# Altium schematic sheet S3C.SchDoc
size A4; Organization: UltraZohm; SheetNumber: 8
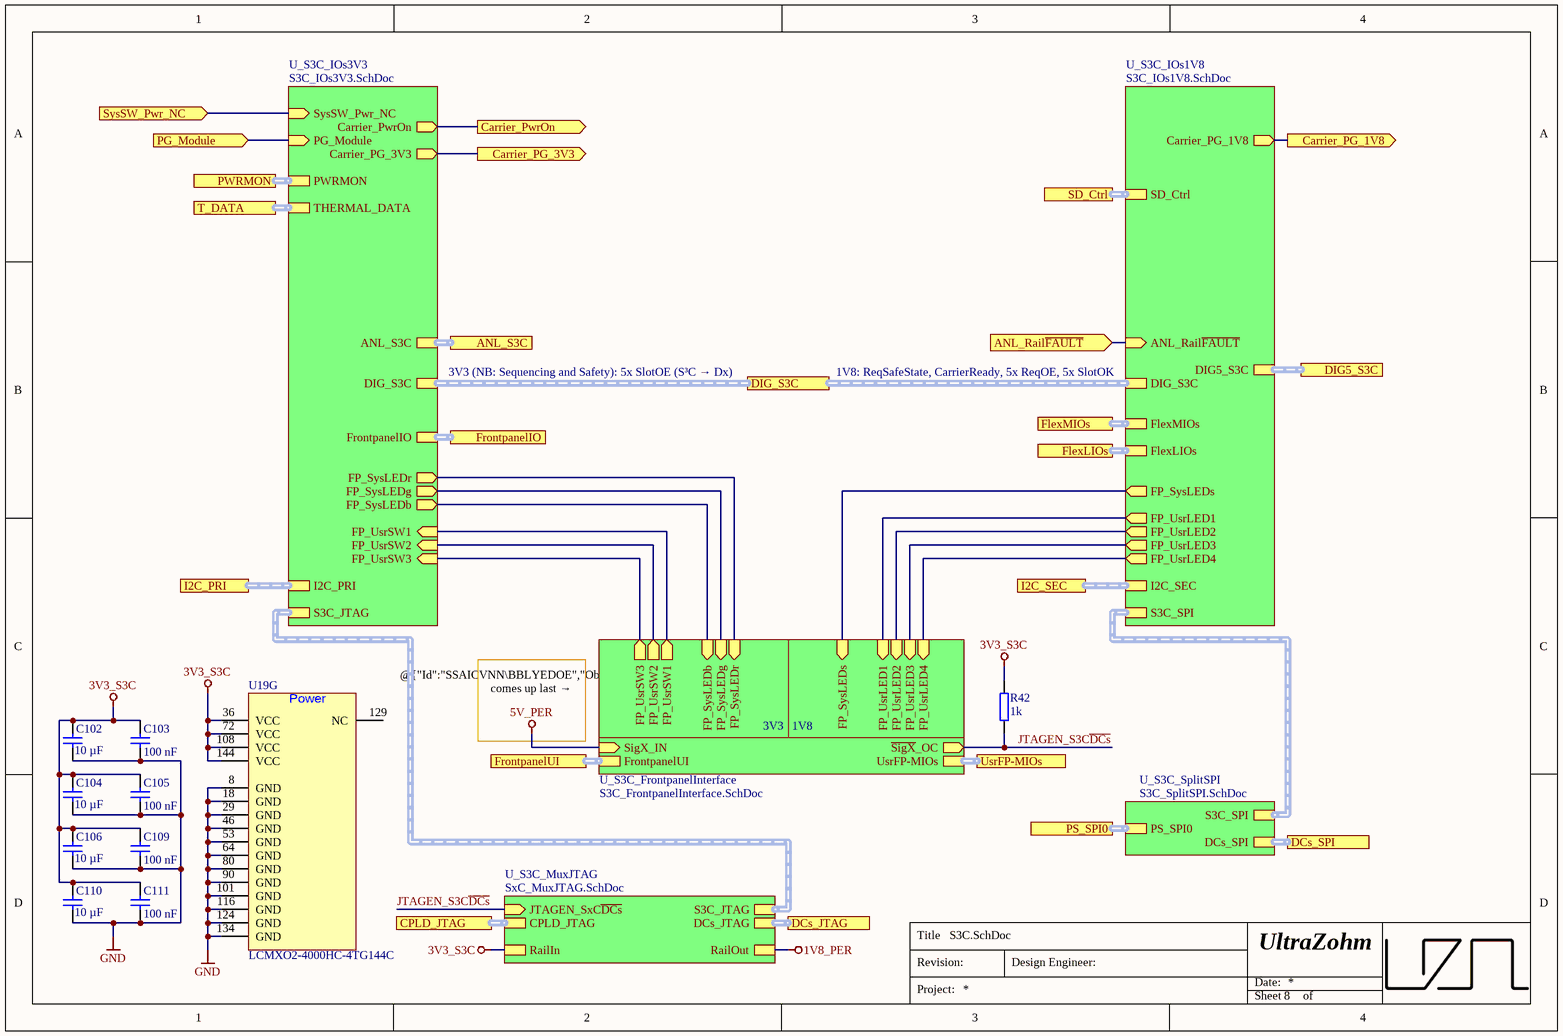
[diagram p0: S3C.SchDoc]

## Parts
C102  10 µF  [C_0603_TE]
C103  100 nF  [C_0603_TE]
C104  10 µF  [C_0603_TE]
C105  100 nF  [C_0603_TE]
C106  10 µF  [C_0603_TE]
C109  100 nF  [C_0603_TE]
C110  10 µF  [C_0603_TE]
C111  100 nF  [C_0603_TE]
R42  1k  [R_0603_TE]
U19  LCMXO2-4000HC-4TG144C  [QFP50P2200X2200X160-144N]  (part G of 7)

## Sub-sheets
U_S3C_FrontpanelInterface = S3C_FrontpanelInterface.SchDoc: SigX_IN (in), ~{SigX}_OC (out), FP_UsrLED1 (in), FP_UsrLED2 (in), FP_UsrLED3 (in), FP_UsrLED4 (in), FP_UsrSW1 (out), FP_UsrSW2 (out), FP_UsrSW3 (out), FP_SysLEDb (in), FP_SysLEDr (in), FP_SysLEDg (in), FP_SysLEDs (in), FrontpanelUI (harness FrontpanelUI), UsrFP-MIOs (harness UsrFP-MIOs)
U_S3C_IOs1V8 = S3C_IOs1V8.SchDoc: S3C_SPI (harness SPI_S3C), FlexMIOs (harness FlexMIOs), DIG5_S3C (harness DIG5_S3C), SD_Ctrl (harness SD_Ctrl), I2C_SEC (harness I2C), FP_UsrLED1 (out), FP_UsrLED2 (out), FP_UsrLED3 (out), FP_UsrLED4 (out), FP_SysLEDs (out), Carrier_PG_1V8 (out), DIG_S3C (harness DIG_S3C), FlexLIOs (harness FlexLIOs), ANL_Rail~{FAULT} (in)
U_S3C_IOs3V3 = S3C_IOs3V3.SchDoc: S3C_JTAG (harness JTAG_S3C), I2C_PRI (harness I2C), SysSW_Pwr_NC (in), THERMAL_DATA (harness T_DATA), FrontpanelIO (harness FrontpanelIO), PWRMON (harness S3C_PWRMON), ANL_S3C (harness ANL_S3C), Carrier_PwrOn (out), PG_Module (in), FP_UsrSW3 (in), FP_UsrSW2 (in), FP_UsrSW1 (in), FP_SysLEDr (out), FP_SysLEDg (out), FP_SysLEDb (out), Carrier_PG_3V3 (out), DIG_S3C (harness DIG_S3C)
U_S3C_MuxJTAG = SxC_MuxJTAG.SchDoc: CPLD_JTAG (harness JTAG), JTAGEN_SxC~{DCs} (in), S3C_JTAG (harness JTAG_S3C), DCs_JTAG (harness JTAG), RailIn, RailOut  | SubSheet_SheetNumber: 11
U_S3C_SplitSPI = S3C_SplitSPI.SchDoc: DCs_SPI (harness SPI_CPLDs), S3C_SPI (harness SPI_S3C), PS_SPI0 (harness SPI)

## Ports
ANL_Rail~{FAULT} (in), ANL_S3C (harness ANL_S3C), Carrier_PG_1V8 (out), Carrier_PG_3V3 (out), Carrier_PwrOn (out), CPLD_JTAG (harness JTAG), DCs_JTAG (harness JTAG), DCs_SPI (harness SPI_CPLDs), DIG5_S3C (harness DIG5_S3C), DIG_S3C (harness DIG_S3C), FlexLIOs (harness FlexLIOs), FlexMIOs (harness FlexMIOs), FrontpanelIO (harness FrontpanelIO), FrontpanelUI (harness FrontpanelUI), I2C_PRI (harness I2C), I2C_SEC (harness I2C), PG_Module (in), PS_SPI0 (harness SPI), PWRMON (harness S3C_PWRMON), SD_Ctrl (harness SD_Ctrl), SysSW_Pwr_NC (in), T_DATA (harness T_DATA), UsrFP-MIOs (harness UsrFP-MIOs)

## Nets
1V8_PER: sheet U_S3C_MuxJTAG/RailOut
3V3_S3C: C102.1 C103.2 C104.1 C105.2 C106.1 C109.2 C110.1 C111.2 R42.2 U19.36(VCC) U19.72(VCC) U19.108(VCC) U19.144(VCC) ; sheet U_S3C_MuxJTAG/RailIn
5V_PER: sheet U_S3C_FrontpanelInterface/SigX_IN
GND: C102.2 C103.1 C104.2 C105.1 C106.2 C109.1 C110.2 C111.1 U19.8(GND) U19.18(GND) U19.29(GND) U19.46(GND) U19.53(GND) U19.64(GND) U19.80(GND) U19.90(GND) U19.101(GND) U19.116(GND) U19.124(GND) U19.134(GND)
ANL_Rail~{FAULT}: port ANL_Rail~{FAULT}, sheet U_S3C_IOs1V8/ANL_Rail~{FAULT}
Carrier_PG_1V8: port Carrier_PG_1V8, sheet U_S3C_IOs1V8/Carrier_PG_1V8
Carrier_PG_3V3: port Carrier_PG_3V3, sheet U_S3C_IOs3V3/Carrier_PG_3V3
Carrier_PwrOn: port Carrier_PwrOn, sheet U_S3C_IOs3V3/Carrier_PwrOn
JTAGEN_S3C~{DCs}: R42.1 ; sheet U_S3C_MuxJTAG/JTAGEN_SxC~{DCs}, sheet U_S3C_FrontpanelInterface/~{SigX}_OC
PG_Module: port PG_Module, sheet U_S3C_IOs3V3/PG_Module
SysSW_Pwr_NC: port SysSW_Pwr_NC, sheet U_S3C_IOs3V3/SysSW_Pwr_NC
(unnamed): sheet U_S3C_IOs3V3/FP_UsrSW3, sheet U_S3C_FrontpanelInterface/FP_UsrSW3
(unnamed): sheet U_S3C_IOs3V3/FP_UsrSW2, sheet U_S3C_FrontpanelInterface/FP_UsrSW2
(unnamed): sheet U_S3C_IOs3V3/FP_UsrSW1, sheet U_S3C_FrontpanelInterface/FP_UsrSW1
(unnamed): sheet U_S3C_IOs3V3/FP_SysLEDr, sheet U_S3C_FrontpanelInterface/FP_SysLEDr
(unnamed): sheet U_S3C_IOs3V3/FP_SysLEDg, sheet U_S3C_FrontpanelInterface/FP_SysLEDg
(unnamed): sheet U_S3C_IOs3V3/FP_SysLEDb, sheet U_S3C_FrontpanelInterface/FP_SysLEDb
(unnamed): sheet U_S3C_IOs1V8/FP_UsrLED1, sheet U_S3C_FrontpanelInterface/FP_UsrLED1
(unnamed): sheet U_S3C_IOs1V8/FP_UsrLED2, sheet U_S3C_FrontpanelInterface/FP_UsrLED2
(unnamed): sheet U_S3C_IOs1V8/FP_UsrLED3, sheet U_S3C_FrontpanelInterface/FP_UsrLED3
(unnamed): sheet U_S3C_IOs1V8/FP_UsrLED4, sheet U_S3C_FrontpanelInterface/FP_UsrLED4
(unnamed): sheet U_S3C_IOs1V8/FP_SysLEDs, sheet U_S3C_FrontpanelInterface/FP_SysLEDs

Not connected (* = marked no-connect by the designer): U19 129(NC)

## Buses and harness runs
harness port ANL_S3C = sheet U_S3C_IOs3V3/ANL_S3C
harness port CPLD_JTAG = sheet U_S3C_MuxJTAG/CPLD_JTAG
harness port DCs_JTAG = sheet U_S3C_MuxJTAG/DCs_JTAG
harness port DCs_SPI = sheet U_S3C_SplitSPI/DCs_SPI
harness port DIG5_S3C = sheet U_S3C_IOs1V8/DIG5_S3C
harness port DIG_S3C = sheet U_S3C_IOs1V8/DIG_S3C = sheet U_S3C_IOs3V3/DIG_S3C
harness port FlexLIOs = sheet U_S3C_IOs1V8/FlexLIOs
harness port FlexMIOs = sheet U_S3C_IOs1V8/FlexMIOs
harness port FrontpanelIO = sheet U_S3C_IOs3V3/FrontpanelIO
harness port FrontpanelUI = sheet U_S3C_FrontpanelInterface/FrontpanelUI
harness port I2C_PRI = sheet U_S3C_IOs3V3/I2C_PRI
harness port I2C_SEC = sheet U_S3C_IOs1V8/I2C_SEC
harness port PS_SPI0 = sheet U_S3C_SplitSPI/PS_SPI0
harness port PWRMON = sheet U_S3C_IOs3V3/PWRMON
harness port SD_Ctrl = sheet U_S3C_IOs1V8/SD_Ctrl
harness port T_DATA = sheet U_S3C_IOs3V3/THERMAL_DATA
harness port UsrFP-MIOs = sheet U_S3C_FrontpanelInterface/UsrFP-MIOs
harness sheet U_S3C_IOs1V8/S3C_SPI = sheet U_S3C_SplitSPI/S3C_SPI
harness sheet U_S3C_IOs3V3/S3C_JTAG = sheet U_S3C_MuxJTAG/S3C_JTAG

## Notes on the sheet
- 3V3 (NB: Sequencing and Safety): 5x SlotOE (S³C → Dx)
- 1V8: ReqSafeState, CarrierReady, 5x ReqOE, 5x SlotOK
- @{"Id":"SSAICVNN\BBLYEDOE","ObjectType":1} comes up last → switch JTAG
- 3V3
- 1V8
- Title
- Revision:
- Design Engineer:
- Date:
- Project:
- Sheet
- of
- (in symbol LCMXO2-4000HC-4TG144C, part G) Power

## Library data of the parts
C102 C104 C106 C110 = UZgen_C_0603_10uF_6.3V_X7R: Generic capacitor; Manufacturer: UZgen; Voltage: 6.3V; Tolerance: 10 %; Created from: UZgenTool; Manufacturer Part Number: UZgen_C_0603_10uF_6.3V_X7R; PartID: 3631; Created On: 02.08.2024 11:17:55; Value: 10 µF; Device Package: 0603; Technology: X7R; Mounting Type: SMD; Last Updated: 02.08.2024 11:17:55
C103 C105 C109 C111 = UZgen_C_0603_100nF_50V_X7R: Generic capacitor; Manufacturer: UZgen; Tolerance: 10 %; Voltage: 50 V; Created from: AGeiger; Value: 100 nF; Technology: X7R; Manufacturer Part Number: UZgen_C_0603_100nF_50V_X7R; PartID: 1; Created On: 02/07/2024 14:42:23; Device Package: 0603; Mounting Type: SMD; Last Updated: 02/08/2024 14:45:57
R42 = UZgen_R_0603_1k: Generic resistor; Manufacturer: UZgen; Tolerance: 1 %; Created from: UZgenTool; Manufacturer Part Number: UZgen_R_0603_1k; PartID: 221; Created On: 02/07/2024 17:29:49; Value: 1k; Device Package: 0603; Mounting Type: SMD; Last Updated: 02/07/2024 17:29:49
U19 = LCMXO2-4000HC-4TG144C: TQFP-144(20x20) Programmable Logic Device (CPLDs/FPGAs) ROHS; Manufacturer: Lattice; Created from: FRosner; Manufacturer Part Number: LCMXO2-4000HC-4TG144C; PartID: 38; Created On: 03/07/2024 17:33:36; ComponentLink1Description: Datasheet; ComponentLink1URL: https://wmsc.lcsc.com/wmsc/upload/file/pdf/v2/lcsc/2403111456_Lattice-LCMXO2-4000HC-4TG144C_C1521625.pdf; Component Type: CPLD; Device Package: TQFP-144; Last Updated: 23/08/2024 11:42:29; Mounting Type: SMD; Operating Temperature: -0 to +85 °C; Supplier 1: LCSC; Supplier Part Number 1: C1521625; Supplier 2: Mouser; Supplier Part Number 2: 842-XO24000HC4TG144C; Type: CPLD; Live Cycle Status: 1; LCSC Part Number: C1521625; Stock number: not stored